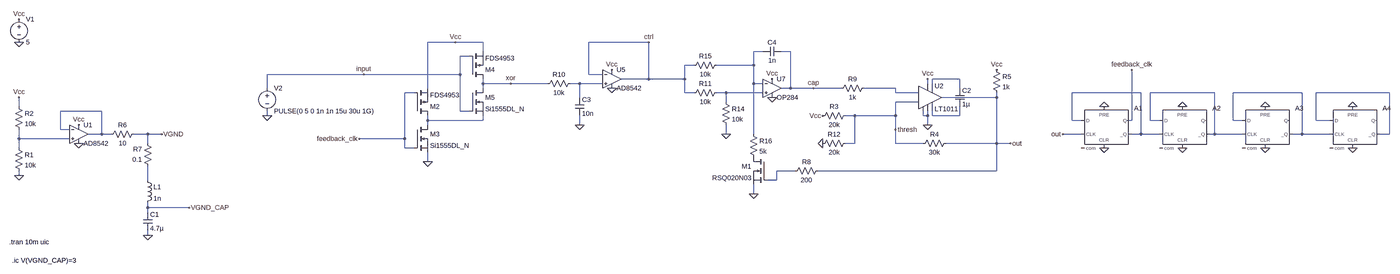
[diagram p0: schematic pll_op_amp_vco.asc, whole sheet]
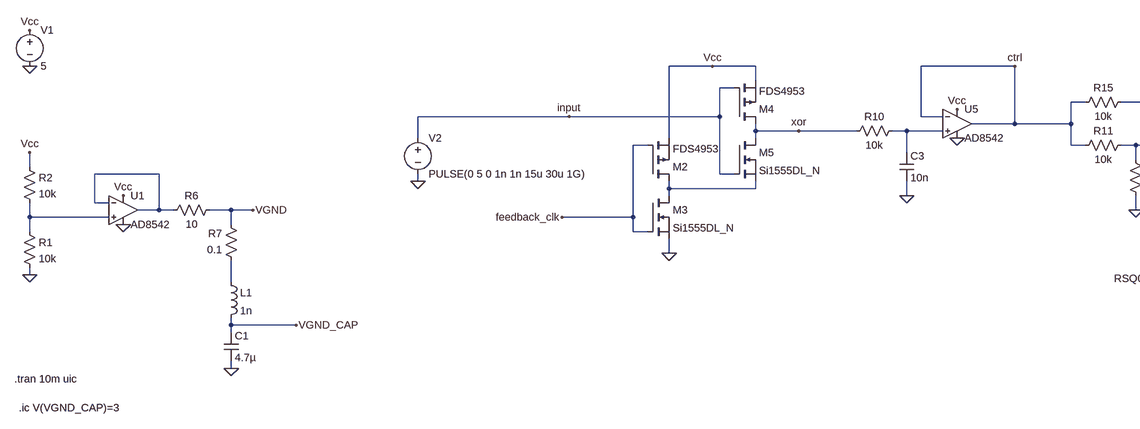
[diagram p1: schematic pll_op_amp_vco.asc, part, row 1 of 1, column 1 of 2]
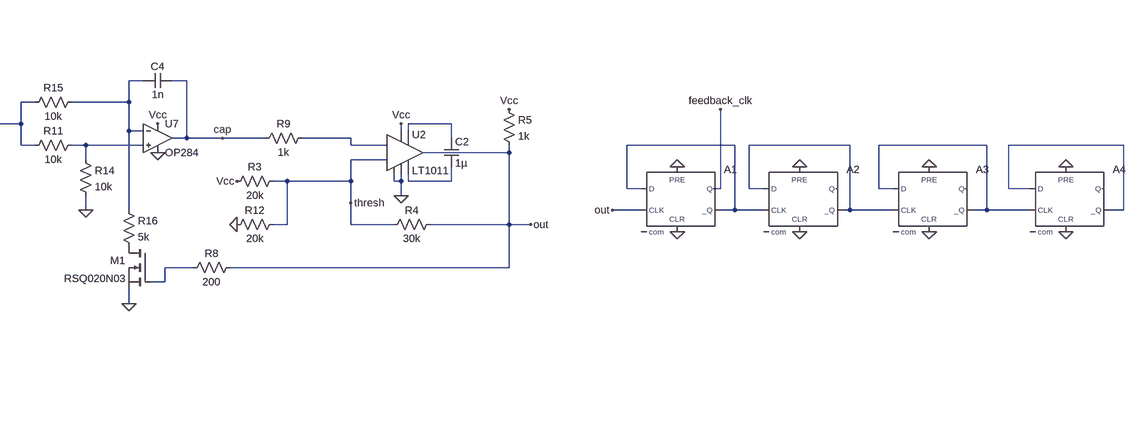
[diagram p2: schematic pll_op_amp_vco.asc, part, row 1 of 1, column 2 of 2]
pll_op_amp_vco.asc, the LTspice schematic file:
Version 4
SHEET 1 4404 1348
WIRE 784 336 688 336
WIRE 880 336 784 336
WIRE 1456 336 1248 336
WIRE 880 368 880 336
WIRE 1888 368 1856 368
WIRE 1984 368 1952 368
WIRE 832 384 800 384
WIRE 1648 416 1616 416
WIRE 1856 416 1856 368
WIRE 1856 416 1728 416
WIRE 464 448 128 448
WIRE 800 448 800 384
WIRE 800 448 464 448
WIRE 1248 448 1248 336
WIRE 1296 448 1248 448
WIRE 1456 464 1456 336
WIRE 1456 464 1360 464
WIRE 1616 464 1616 416
WIRE 1616 464 1456 464
WIRE 2608 464 2512 464
WIRE 880 480 880 464
WIRE 976 480 880 480
WIRE 1104 480 976 480
WIRE 1216 480 1184 480
WIRE 1296 480 1216 480
WIRE 1856 480 1856 416
WIRE 1888 480 1856 480
WIRE 2496 480 2496 464
WIRE 2512 480 2512 464
WIRE 128 496 128 448
WIRE 688 496 688 336
WIRE 880 496 880 480
WIRE 1984 496 1984 368
WIRE 1984 496 1952 496
WIRE 2064 496 1984 496
WIRE 2160 496 2064 496
WIRE 2384 496 2240 496
WIRE 2608 496 2608 464
WIRE 640 512 608 512
WIRE 1616 512 1616 464
WIRE 1648 512 1616 512
WIRE 1760 512 1728 512
WIRE 1888 512 1760 512
WIRE 2384 512 2384 496
WIRE 2464 512 2384 512
WIRE 3536 512 3296 512
WIRE 3792 512 3568 512
WIRE 4096 512 3856 512
WIRE 4400 512 4144 512
WIRE 1216 528 1216 480
WIRE 2736 528 2736 512
WIRE 2736 528 2544 528
WIRE 1760 544 1760 512
WIRE 2464 544 2384 544
WIRE -800 560 -800 528
WIRE -512 576 -656 576
WIRE 800 576 800 448
WIRE 832 576 800 576
WIRE 128 592 128 576
WIRE 2208 592 2176 592
WIRE 2384 592 2384 544
WIRE 2384 592 2208 592
WIRE 2480 592 2480 576
WIRE 2496 592 2496 576
WIRE 2496 592 2480 592
WIRE 2512 592 2512 576
WIRE 2608 592 2608 560
WIRE 2608 592 2512 592
WIRE 688 608 688 592
WIRE 880 608 880 592
WIRE 880 608 688 608
WIRE 3296 608 3296 512
WIRE 3328 608 3296 608
WIRE 3504 608 3504 432
WIRE 3504 608 3488 608
WIRE 3568 608 3568 512
WIRE 3600 608 3568 608
WIRE 3856 608 3856 512
WIRE 3888 608 3856 608
WIRE 4144 608 4144 512
WIRE 4192 608 4144 608
WIRE 688 624 688 608
WIRE 1216 624 1216 592
WIRE 2496 624 2496 592
WIRE -656 640 -656 576
WIRE -624 640 -656 640
WIRE 2384 640 2384 592
WIRE -512 656 -512 576
WIRE -512 656 -560 656
WIRE -480 656 -512 656
WIRE -352 656 -400 656
WIRE -304 656 -352 656
WIRE 1760 656 1760 624
WIRE 1856 656 1856 480
WIRE 3328 656 3264 656
WIRE 3536 656 3536 512
WIRE 3536 656 3504 656
WIRE 3600 656 3536 656
WIRE 3792 656 3792 512
WIRE 3792 656 3776 656
WIRE 3888 656 3792 656
WIRE 4096 656 4096 512
WIRE 4096 656 4064 656
WIRE 4192 656 4096 656
WIRE 4400 656 4400 512
WIRE 4400 656 4368 656
WIRE -800 672 -800 640
WIRE -624 672 -800 672
WIRE 608 672 608 512
WIRE 608 672 448 672
WIRE -352 688 -352 656
WIRE 2208 688 2208 592
WIRE 2208 688 2176 688
WIRE 2384 688 2384 640
WIRE 2480 688 2384 688
WIRE 2736 688 2736 528
WIRE 2736 688 2560 688
WIRE 2784 688 2736 688
WIRE -800 704 -800 672
WIRE 608 704 608 672
WIRE 640 704 608 704
WIRE 688 752 688 720
WIRE 2000 784 1936 784
WIRE 2736 784 2736 688
WIRE 2736 784 2080 784
WIRE -800 800 -800 784
WIRE -352 816 -352 768
WIRE 1936 816 1936 784
WIRE 1936 816 1904 816
WIRE 1856 864 1856 832
WIRE -352 912 -352 896
WIRE -208 912 -352 912
WIRE -352 928 -352 912
WIRE -352 1008 -352 992
FLAG -592 624 Vcc
FLAG -592 688 0
FLAG -800 800 0
FLAG -800 528 Vcc
FLAG -800 336 0
FLAG -800 256 Vcc
FLAG -304 656 VGND
FLAG -352 1008 0
FLAG 2784 688 out
FLAG 1328 432 Vcc
FLAG 1920 464 Vcc
FLAG 1328 496 0
FLAG 1920 528 0
FLAG 2064 496 cap
FLAG 128 592 0
FLAG 448 672 feedback_clk
FLAG 2496 464 Vcc
FLAG -208 912 VGND_CAP
FLAG 1456 336 ctrl
FLAG 2384 640 thresh
FLAG 1760 656 0
FLAG 1856 864 0
FLAG 2496 624 0
FLAG 2736 432 Vcc
FLAG 1216 624 0
FLAG 688 752 0
FLAG 784 336 Vcc
FLAG 464 448 input
FLAG 976 480 xor
FLAG 3408 704 0
FLAG 3680 704 0
FLAG 3968 704 0
FLAG 3968 560 0
FLAG 3680 560 0
FLAG 3408 560 0
FLAG 4272 704 0
FLAG 4272 560 0
FLAG 3264 656 out
FLAG 3504 432 feedback_clk
FLAG 2096 688 0
FLAG 2096 592 Vcc
SYMBOL OpAmps\\AD8542 -592 592 R0
SYMATTR InstName U1
SYMBOL res -816 688 R0
SYMATTR InstName R1
SYMATTR Value 10k
SYMBOL res -816 544 R0
SYMATTR InstName R2
SYMATTR Value 10k
SYMBOL voltage -800 240 R0
WINDOW 123 0 0 Left 0
WINDOW 39 0 0 Left 0
SYMATTR InstName V1
SYMATTR Value 5
SYMBOL res -384 640 R90
WINDOW 0 0 56 VBottom 2
WINDOW 3 32 56 VTop 2
SYMATTR InstName R6
SYMATTR Value 10
SYMBOL cap -368 928 R0
SYMATTR InstName C1
SYMATTR Value 4.7µ
SYMBOL res -336 784 R180
WINDOW 0 36 76 Left 2
WINDOW 3 36 40 Left 2
SYMATTR InstName R7
SYMATTR Value 0.1
SYMBOL ind -368 800 R0
SYMATTR InstName L1
SYMATTR Value 1n
SYMBOL res 1200 464 R90
WINDOW 0 0 56 VBottom 2
WINDOW 3 32 56 VTop 2
SYMATTR InstName R10
SYMATTR Value 10k
SYMBOL cap 1200 528 R0
SYMATTR InstName C3
SYMATTR Value 10n
SYMBOL res 1744 496 R90
WINDOW 0 0 56 VBottom 2
WINDOW 3 32 56 VTop 2
SYMATTR InstName R11
SYMATTR Value 10k
SYMBOL res 1744 528 R0
SYMATTR InstName R14
SYMATTR Value 10k
SYMBOL res 1744 400 R90
WINDOW 0 0 56 VBottom 2
WINDOW 3 32 56 VTop 2
SYMATTR InstName R15
SYMATTR Value 10k
SYMBOL cap 1952 352 R90
WINDOW 0 0 32 VBottom 2
WINDOW 3 32 32 VTop 2
SYMATTR InstName C4
SYMATTR Value 1n
SYMBOL res 1840 640 R0
SYMATTR InstName R16
SYMATTR Value 5k
SYMBOL voltage 128 480 R0
WINDOW 123 0 0 Left 0
WINDOW 39 0 0 Left 0
SYMATTR InstName V2
SYMATTR Value PULSE(0 5 0 1n 1n 15u 30u 1G)
SYMBOL OpAmps\\OP284 1920 432 R0
SYMATTR InstName U7
SYMBOL OpAmps\\AD8542 1328 400 R0
SYMATTR InstName U5
SYMBOL res 2192 576 R90
WINDOW 0 0 56 VBottom 2
WINDOW 3 32 56 VTop 2
SYMATTR InstName R3
SYMATTR Value 20k
SYMBOL res 2576 672 R90
WINDOW 0 0 56 VBottom 2
WINDOW 3 32 56 VTop 2
SYMATTR InstName R4
SYMATTR Value 30k
SYMBOL Comparators\\LT1011 2496 528 R0
SYMATTR InstName U2
SYMBOL res 2720 416 R0
SYMATTR InstName R5
SYMATTR Value 1k
SYMBOL cap 2592 496 R0
SYMATTR InstName C2
SYMATTR Value 1µ
SYMBOL res 2096 768 R90
WINDOW 0 0 56 VBottom 2
WINDOW 3 32 56 VTop 2
SYMATTR InstName R8
SYMATTR Value 200
SYMBOL res 2256 480 R90
WINDOW 0 0 56 VBottom 2
WINDOW 3 32 56 VTop 2
SYMATTR InstName R9
SYMATTR Value 1k
SYMBOL pmos 640 592 M180
SYMATTR InstName M2
SYMATTR Value FDS4953
SYMBOL nmos 640 624 R0
SYMATTR InstName M3
SYMATTR Value Si1555DL_N
SYMBOL pmos 832 464 M180
SYMATTR InstName M4
SYMATTR Value FDS4953
SYMBOL nmos 832 496 R0
SYMATTR InstName M5
SYMATTR Value Si1555DL_N
SYMBOL Digital\\dflop 3408 560 R0
WINDOW 3 0 0 Invisible 0
SYMATTR InstName A1
SYMATTR Value2 Vhigh=5 Vlow=0
SYMATTR Value Ref=2.5
SYMATTR SpiceLine Td=2n Trise=10n Tfall=10n
SYMBOL Digital\\dflop 3680 560 R0
WINDOW 3 0 0 Invisible 0
SYMATTR InstName A2
SYMATTR Value2 Vhigh=5 Vlow=0
SYMATTR Value Ref=2.5
SYMATTR SpiceLine Td=2n Trise=10n Tfall=10n
SYMBOL Digital\\dflop 3968 560 R0
WINDOW 3 0 0 Invisible 0
SYMATTR InstName A3
SYMATTR Value2 Vhigh=5 Vlow=0
SYMATTR Value Ref=2.5
SYMATTR SpiceLine Td=2n Trise=10n Tfall=10n
SYMBOL Digital\\dflop 4272 560 R0
WINDOW 3 0 0 Invisible 0
SYMATTR InstName A4
SYMATTR Value2 Vhigh=5 Vlow=0
SYMATTR Value Ref=2.5
SYMATTR SpiceLine Td=2n Trise=10n Tfall=10n
SYMBOL res 2192 672 R90
WINDOW 0 0 56 VBottom 2
WINDOW 3 32 56 VTop 2
SYMATTR InstName R12
SYMATTR Value 20k
SYMBOL nmos 1904 736 M0
SYMATTR InstName M1
SYMATTR Value RSQ020N03
TEXT -834 1032 Left 2 !.tran 10m uic
TEXT -824 1096 Left 2 !.ic V(VGND_CAP)=3

The netlist it stands for:
* pll_op_amp_vco.asc
XU1 N013 N010 Vcc 0 N010 AD8542  ; pins In+ In- V+ V- OUT
R1 N013 0 10k
R2 Vcc N013 10k
V1 Vcc 0 5
R6 VGND N010 10
C1 VGND_CAP 0 4.7µ
R7 N015 VGND 0.1
L1 N015 VGND_CAP 1n
R10 N003 xor 10k
C3 N003 0 10n
R11 N005 ctrl 10k
R14 N005 0 10k
R15 N001 ctrl 10k
C4 cap N001 1n
R16 N001 P001 5k
V2 input 0 PULSE(0 5 0 1n 1n 15u 30u 1G)
XU7 N005 N001 Vcc 0 cap OP284  ; pins In+ In- V+ V- OUT
XU5 N003 ctrl Vcc 0 ctrl AD8542  ; pins In+ In- V+ V- OUT
R3 thresh Vcc 20k
R4 out thresh 30k
XU2 0 thresh N004 0 N002 N011 out Vcc LT1011
R5 Vcc out 1k
C2 N002 N011 1µ
R8 out N014 200
R9 N004 cap 1k
M2 N012 feedback_clk Vcc Vcc FDS4953
M3 N012 feedback_clk 0 0 Si1555DL_N
M4 xor input Vcc Vcc FDS4953
M5 xor input N012 N012 Si1555DL_N
A1 N006 0 out 0 0 N006 feedback_clk 0 DFLOP Ref=2.5 Vhigh=5 Vlow=0 Td=2n Trise=10n Tfall=10n
A2 N007 0 N006 0 0 N007 0 0 DFLOP Ref=2.5 Vhigh=5 Vlow=0 Td=2n Trise=10n Tfall=10n
A3 N008 0 N007 0 0 N008 0 0 DFLOP Ref=2.5 Vhigh=5 Vlow=0 Td=2n Trise=10n Tfall=10n
A4 N009 0 N008 0 0 N009 0 0 DFLOP Ref=2.5 Vhigh=5 Vlow=0 Td=2n Trise=10n Tfall=10n
R12 thresh 0 20k
M1 P001 N014 0 0 RSQ020N03
.model NMOS NMOS
.model PMOS PMOS
.lib standard.mos
.tran 10m uic
.ic V(VGND_CAP)=3
.lib AD8542.sub
.lib ADI1.lib
.lib LTC1.lib
.backanno
.end